# Altium project power_supply_IAC_2025.PrjPcb
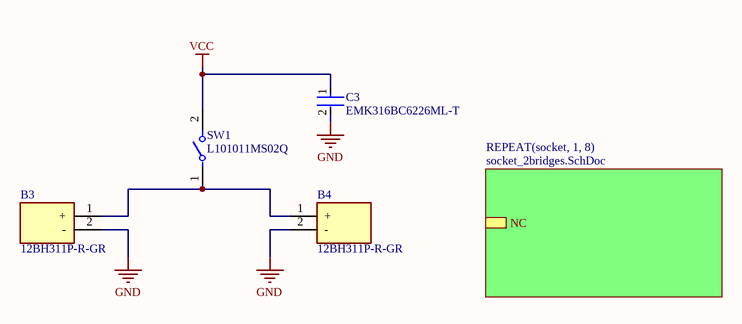
[diagram p0: main.SchDoc]
2 sheets, 92 parts. Net scope: hierarchical (ports join the sheet entries above them; power ports are global).
Board file: pcb.PcbDoc
Sheets:
  main.SchDoc
    socket1 = socket_2bridges.SchDoc
    socket2 = socket_2bridges.SchDoc
    socket3 = socket_2bridges.SchDoc
    socket4 = socket_2bridges.SchDoc
    socket5 = socket_2bridges.SchDoc
    socket6 = socket_2bridges.SchDoc
    socket7 = socket_2bridges.SchDoc
    socket8 = socket_2bridges.SchDoc

## Sheet main.SchDoc
size A4; SheetNumber: 1; SheetTotal: 2

### Parts
B3  12BH311P-R-GR  [12BH311PRGR]
B4  12BH311P-R-GR  [12BH311PRGR]
C3  EMK316BC6226ML-T  [FP-1206-L_3_2_0_3-W_1_6_0-IPC_A]
SW1  L101011MS02Q  [FP-L101011MS02Q-MFG]

### Sub-sheets
REPEAT(socket, 1, 8) = socket_2bridges.SchDoc: NC

### Nets
GND: B3.2(-) B4.2(-) C3.2  [project net LOADCELL_N1]
VCC: C3.1 SW1.2
NetB3_1: B3.1(+) B4.1(+) SW1.1

### Library data of the parts
B3 B4 = 12BH311P-R-GR: Cylindrical Battery Contacts, Clips, Holders & Springs 1 "AA" PC LDS W/RIB; Manufacturer_Name: Eagle Plastic Devices; Geometry.Height: 14.4mm; Mouser Part Number: 12BH311P-R-GR; Mouser Price/Stock: https://www.mouser.co.uk/ProductDetail/Eagle-Plastic-Devices/12BH311P-R-GR?qs=xlWIvxljzP5Z0EAaeyyPGg%3D%3D; Manufacturer_Part_Number: 12BH311P-R-GR; Datasheet Link: *
C3 = CMP-14477-000320-2: None; Tolerance: 20%; Voltage Rating: 16V; Capacitance: 22uF; Dielectric: X6S; Case Code (Imperial): 1206; Length: 0.126inch; Mount: Surface Mount; Thickness: 0.071inch; Width: 0.063inch; Lead Free: Lead Free; Case Code (Metric): 3216; Max Operating Temperature: 105°C; Case/Package: 1206; Min Operating Temperature: -55°C; Packaging: Tape and Reel
SW1 = CMP-10038-000020-1: SWITCH SLIDE SPST 4A 125V; Actuator Length: 5.08mm; Actuator Type: Standard; Contact Current Rating: 2A; Electrical Life: 10000Cycles; Switch Function: On-Off; Voltage Rating (DC): 28V; Actuator Color: Black; Actuator Material: Nylon; Switch Travel: 3.81mm; Max Voltage Rating (AC): 250V; Max Current Rating: 4A; Contact Plating: Silver; Throw Configuration: SPST; Depth: 10.8mm; Package Quantity: 1; Length: 19.1mm; Current Rating: 4A; Max Operating Temperature: 65°C; Orientation: Straight; Radiation Hardening: No; Termination: PC Pins; Max Voltage Rating (DC): 125V; Series: L; Min Operating Temperature: -30°C; Contact Material: Copper; Lead Free: Lead Free; Mount: Through Hole; RoHS Compliant: Yes; Voltage Rating (AC): 125V; Packaging: Bulk; Housing Material: Nylon

## Sheet socket_2bridges.SchDoc
size A4; SheetNumber: 2; SheetTotal: 2
Used 8 times, as channels socket1, socket2, socket3, socket4, socket5, socket6, socket7, socket8. Parts and nets are listed once, with the designators drawn on the sheet.
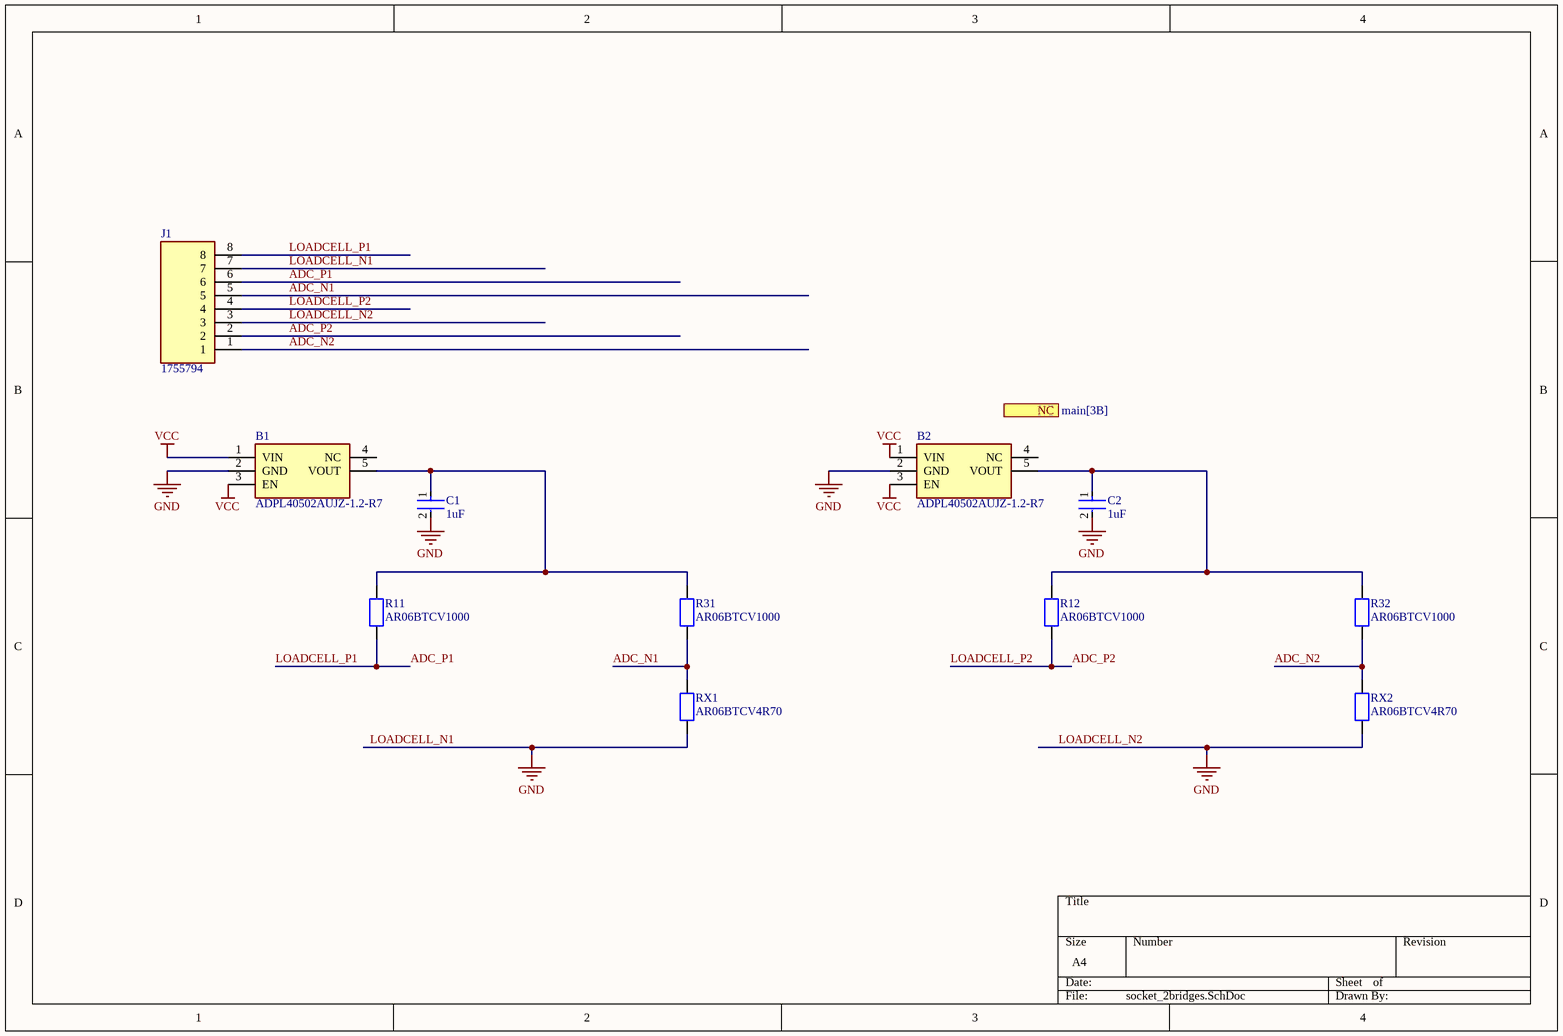
[diagram p1: socket_2bridges.SchDoc]

### Parts
B1  ADPL40502AUJZ-1.2-R7  [SOT95P280X100-5N]
B2  ADPL40502AUJZ-1.2-R7  [SOT95P280X100-5N]
C1  1uF  [FP-CGA5L-0_3-0_1-IPC_A]
C2  1uF  [FP-CGA5L-0_3-0_1-IPC_A]
J1  1755794  [1755794]
R11  AR06BTCV1000  [AR06]
R12  AR06BTCV1000  [AR06]
R31  AR06BTCV1000  [AR06]
R32  AR06BTCV1000  [AR06]
RX1  AR06BTCV4R70  [AR06]
RX2  AR06BTCV4R70  [AR06]

### Ports
NC (see main[3B])

### Nets
LOADCELL_N1: B1.2(GND) B2.2(GND) C1.2 C2.2 J1.3 J1.7 RX1.1 RX2.1  [also labelled GND, LOADCELL_N2]
VCC: B1.1(VIN) B1.3(EN) B2.1(VIN) B2.3(EN)
ADC_N1: J1.5 R31.1 RX1.2
ADC_N2: J1.1 R32.1 RX2.2
ADC_P1: J1.6 J1.8 R11.1  [also labelled LOADCELL_P1]
ADC_P2: J1.2 J1.4 R12.1  [also labelled LOADCELL_P2]
NetB1_5: B1.5(VOUT) C1.1 R11.2 R31.2
NetB2_5: B2.5(VOUT) C2.1 R12.2 R32.2

Not connected (* = marked no-connect by the designer): B1 4(NC); B2 4(NC)

### Channels
socket1: designators end in _socket1; ports NC=open
socket2: designators end in _socket2; ports NC=open
socket3: designators end in _socket3; ports NC=open
socket4: designators end in _socket4; ports NC=open
socket5: designators end in _socket5; ports NC=open
socket6: designators end in _socket6; ports NC=open
socket7: designators end in _socket7; ports NC=open
socket8: designators end in _socket8; ports NC=open

### Library data of the parts
B1 B2 = ADPL40502AUJZ-1.2-R7: Low Noise, 200mA, CMOS Linear Regulator; Manufacturer_Name: Analog Devices; Geometry.Height: 1mm; Mouser Part Number: *; Mouser Price/Stock: *; Manufacturer_Part_Number: ADPL40502AUJZ-1.2-R7; Datasheet Link: https://www.analog.com/ADPL40502/datasheet
C1 C2 = CMP-08246-001699-1: Cap Ceramic 1uF 25V X7R 10% Pad SMD 1206 +125°C Automotive T/R; Max Operating Temperature: 125°C; Weight: 0.000571oz; Package Quantity: 2000; Width: 1.6mm; Voltage Rating: 25V; REACH SVHC: No SVHC; Height: 1.6mm; Min Operating Temperature: -55°C; Mount: Surface Mount; Case/Package: 1206; Ratings: AEC-Q200; Case Code (Imperial): 1206; Capacitance: 1uF; Termination: SMD/SMT; Length: 3.2mm; Depth: 1.6mm; Thickness: 0.075inch; Packaging: Tape and Reel; Tolerance: 10%; Dielectric: X7R; Case Code (Metric): 3216; Voltage Rating (DC): 25V; Composition: Ceramic
J1 = 1755794: Connector; Manufacturer_Name: Phoenix Contact; Datasheet Link: http://www.phoenixcontact.com/de/produkte/1755794/pdf; Height: 12.15mm; Manufacturer_Part_Number: 1755794; Mouser Part Number: 651-1755794; Mouser Price/Stock: https://www.mouser.co.uk/ProductDetail/Phoenix-Contact/1755794?qs=wd%252Bw3mUqFrk%2FIOZ4HDo8lg%3D%3D; Arrow Part Number: 1755794; Arrow Price/Stock: https://www.arrow.com/en/products/1755794/phoenix-contact?utm_currency=USD&region=nac

## Nets that join several sheets
LOADCELL_N1: main (B3.2 B4.2 C3.2), socket1 (8 pins), socket2 (8 pins), socket3 (8 pins), socket4 (8 pins), socket5 (8 pins), socket6 (8 pins), socket7 (8 pins), socket8 (8 pins)
VCC: main (C3.1 SW1.2), socket1 (B1_socket1.1 B1_socket1.3 B2_socket1.1 B2_socket1.3), socket2 (B1_socket2.1 B1_socket2.3 B2_socket2.1 B2_socket2.3), socket3 (B1_socket3.1 B1_socket3.3 B2_socket3.1 B2_socket3.3), socket4 (B1_socket4.1 B1_socket4.3 B2_socket4.1 B2_socket4.3), socket5 (B1_socket5.1 B1_socket5.3 B2_socket5.1 B2_socket5.3), socket6 (B1_socket6.1 B1_socket6.3 B2_socket6.1 B2_socket6.3), socket7 (B1_socket7.1 B1_socket7.3 B2_socket7.1 B2_socket7.3), socket8 (B1_socket8.1 B1_socket8.3 B2_socket8.1 B2_socket8.3)